# Altium schematic sheet Power_Connections.SchDoc
size A; SheetNumber: 1; SheetTotal: 6
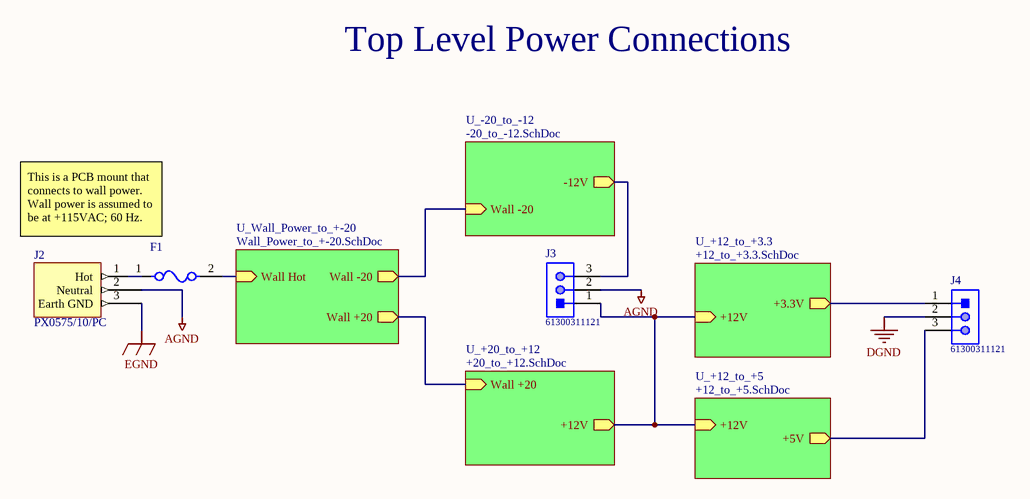
[diagram p0: Power_Connections.SchDoc]

## Parts
F1  C1F 3  [FP-0466-MFG]  (value not drawn)
J2  PX0575/10/PC  [PCBComponent_1]
J3  61300311121  [61300311121]
J4  61300311121  [61300311121]

## Sub-sheets
U_+12_to_+3.3 = +12_to_+3.3.SchDoc: +3.3V (out), +12V (in)
U_+12_to_+5 = +12_to_+5.SchDoc: +5V (out), +12V (in)
U_+20_to_+12 = +20_to_+12.SchDoc: Wall +20 (in), +12V (out)
U_-20_to_-12 = -20_to_-12.SchDoc: Wall -20 (in), -12V (out)
U_Wall_Power_to_+-20 = Wall_Power_to_+-20.SchDoc: Wall -20 (out), Wall +20 (out), Wall Hot (in)

## Nets
AGND: J2.2(Neutral) J3.2
DGND: J4.2
EGND: J2.3(Earth_GND)
NetF1_1: F1.1 J2.1(Hot)
NetF1_2: F1.2 ; sheet U_Wall_Power_to_+-20/Wall Hot
NetJ3_1: J3.1 ; sheet U_+12_to_+3.3/+12V, sheet U_+12_to_+5/+12V, sheet U_+20_to_+12/+12V
NetJ3_3: J3.3 ; sheet U_-20_to_-12/-12V
NetJ4_1: J4.1 ; sheet U_+12_to_+3.3/+3.3V
NetJ4_3: J4.3 ; sheet U_+12_to_+5/+5V
(unnamed): sheet U_-20_to_-12/Wall -20, sheet U_Wall_Power_to_+-20/Wall -20
(unnamed): sheet U_Wall_Power_to_+-20/Wall +20, sheet U_+20_to_+12/Wall +20

## Notes on the sheet
- Top Level Power Connections
- This is a PCB mount that connects to wall power.  Wall power is assumed to be at +115VAC; 60 Hz.

## Library data of the parts
F1 = CMP-08605-000081-1: FUSE BOARD MNT 200MA 125VAC/VDC; Body Material: Thermoplastic; Voltage Rating: 125V; Fuse Type: Board Mount (Cartridge Style Excluded); Resistance: 1.15R; Approvals: UL; DC Cold Resistance: 1.16R; Case Code (Metric): 3216; Depth: 1.52mm; Case/Package: 1206; Lead Free: Lead Free; Length: 3.18mm; Max Operating Temperature: 90°C; Case Code (Imperial): 1206; Terminal Material: Copper; Radiation Hardening: No; Working Voltage: 125V; Packaging: Tape and Reel; Width: 0.06inch; Housing Material: Ceramic; Voltage Rating (AC): 125V; Current Rating: 200mA; Fuse Current: 200mA; Package Quantity: 5000; Height: 0.023inch; Termination: SMD/SMT; Voltage Rating (DC): 125V; Mount: Surface Mount; Min Operating Temperature: -55°C; Number of Pins: 2
J2 = CMP-002-00071-6: Conn Inlet M 3 POS 9.17mm Solder RA Thru-Hole 3 Terminal 1 Port Bulk
J3 J4 = CMP-1502-01062-1: THT Vertical Pin Header WR-PHD, Pitch 2.54 mm, Single Row, 3 pins; Manufacturer: Wurth Elektronik; Withstanding Voltage: 500VAC; Working Voltage: 250VAC; Rated Current: 3A; Pitch: 2.54mm; Pin Number: 3; Gender: Male; Contact Resistance: 20mOhm; Package Reference: 61300311121; Manufacturer URL: http://www.we-online.de; Datasheet URL: https://katalog.we-online.de/em/datasheet/6130xx11121.pdf; Operating Temperature: -40to105degC; Part Number: 61300311121; Orientation: Vertical; Packaging: Bag; Row Number: Single; Mounting Technology: THT; Publisher: WurthElektronik